# Altium schematic sheet ADC_Reference_Voltage.SchDoc
size A4; CompanyName: Technische Hochschule Nürnberg Georg Simon Ohm; Organization: UltraZohm; Address1: Kesslerplatz 12; Address2: 90489 Nürnberg; Address3: GERMANY; DocumentNumber: 8; SheetNumber: 8; SheetTotal: 9; Website: www.ultrazohm.com
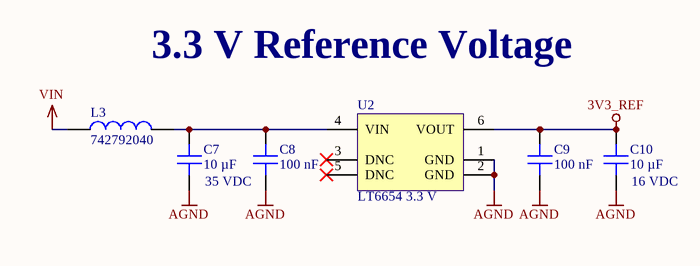
[diagram p0: ADC_Reference_Voltage.SchDoc]

## Parts
C7  10 µF  Voltage Rating: 35 VDC  [CAPC_0805_L]
C8  100 nF  [C_0603]
C9  100 nF  [C_0603]
C10  10 µF  Voltage Rating: 16 VDC  [C_0603]
L3  742792040  [WE-CBF_0805_High Current]
U2  LT6654 3.3 V  [SOT95P280X100-6N]

## Nets
3V3_REF: C9.2 C10.2 U2.6(VOUT)
AGND: C7.1 C8.1 C9.1 C10.1 U2.1(GND) U2.2(GND)
VIN: L3.1
NetC7_2: C7.2 C8.2 L3.2 U2.4(VIN)

Not connected (* = marked no-connect by the designer): U2 3(DNC)* 5(DNC)*

## Notes on the sheet
- 3.3 V Reference Voltage
- Title
- Revision:
- Design Engineer:
- Date:
- Project:
- Sheet
- of

## Library data of the parts
C7 = GRM21BR6YA106KE43L: Capacitor 0805, 35 VDC, 10 µF, X5R; Manufacturer: Murata Electronics; Tolerance: 10 %; Created from: AGeiger; Manufacturer Part Number: GRM21BR6YA106KE43L; PartID: 28; Created On: 20.12.2020 13:54:13; ComponentLink1Description: Datasheet; ComponentLink1URL: https://www.mouser.de/datasheet/2/281/murata_03052018_GRM_Series_1-1310166.pdf; Component Type: Capacitor 0805; Device Package: 0805; Last Updated: 25.08.2022 14:37:40; Mounting Type: SMD; Operating Temperature: -55 - 85°C; Series: GRM; Supplier 1: Mouser; Supplier Part Number 1: 81-GRM21BR6YA106KE3L; Type: Capacitor; Value: 10 µF; Live Cycle Status: 1; LCSC Part Number: C162422; Stock number: Labor SMD Container
C8 C9 = CC0603KRX7R9BB104: Capacitor 0603, 50 VDC, 100 nF, X7R; Manufacturer: YAGEO; Tolerance: 10 %; Voltage Rating: 50 VDC; Created from: AGeiger; Manufacturer Part Number: CC0603KRX7R9BB104; PartID: 102; Created On: 22.08.2022 14:35:53; ComponentLink1Description: Datasheet; ComponentLink1URL: https://datasheet.lcsc.com/lcsc/1809301912_YAGEO-CC0603KRX7R9BB104_C14663.pdf; Component Type: Capacitor 0603; Device Package: 0603; Last Updated: 22.08.2022 14:35:53; Mounting Type: SMD; Operating Temperature: -55 - 125°C; Series: X7R; Supplier 1: LCSC; Supplier Part Number 1: C14663; Supplier 2: Mouser; Supplier Part Number 2: 603-CC603KRX7R9BB104; Type: Capacitor; Value: 100 nF; Live Cycle Status: 1; LCSC Part Number: C14663
C10 = CL10A106MO8NQNC: Capacitor 0603, 16 VDC, 10 µF, X5R; Manufacturer: Samsung Electro-Mechanics; Tolerance: 20 %; Created from: AGeiger; Manufacturer Part Number: CL10A106MO8NQNC; PartID: 101; Created On: 22.08.2022 13:56:44; ComponentLink1Description: Datasheet; ComponentLink1URL: https://datasheet.lcsc.com/lcsc/1810261909_Samsung-Electro-Mechanics-CL10A106MO8NQNC_C92487.pdf; Component Type: Capacitor 0603; Device Package: 0603; Last Updated: 22.08.2022 13:56:44; Mounting Type: SMD; Operating Temperature: -55 - 85°C; Supplier 1: LCSC; Supplier Part Number 1: C92487; Type: Capacitor; Value: 10 µF; Live Cycle Status: 1; LCSC Part Number: C92487
L3 = 742792040: Inductance, 0805, 100 MHz, 600 Ohm, 2 A; Manufacturer: Wurth Elektronik; Type: Inductance SMD; DC current: 2 A; Value: 600 Ohm; Created from: AGeiger; Manufacturer Part Number: 742792040; PartID: 1; Created On: 18.01.2021 14:53:17; ComponentLink1Description: Datasheet; ComponentLink1URL: https://www.mouser.de/datasheet/2/445/742792040-1720361.pdf; Component Type: Inductance; Device Package: 0805; Last Updated: 29.08.2022 15:04:37; Mounting Type: SMD; Operating Temperature: -55 - 125 °C; Series: WE-CBF; Supplier 1: Mouser; Supplier Part Number 1: 710-742792040; Live Cycle Status: 1; Stock number: not stored; LCSC Part Number: C2661857
U2 = LT6654AIS6-3.3#TRMPBF: Voltage Reference, 3.3V, ±0.05%, ±10mA; Manufacturer: Analog Devices; Created from: AGeiger; Manufacturer Part Number: LT6654AIS6-3.3#TRMPBF; PartID: 11; Created On: 25.08.2022 15:15:35; ComponentLink1Description: Datasheet; ComponentLink1URL: https://datasheet.lcsc.com/lcsc/2009111208_Analog-Devices-LT6654AIS6-3-3-TRMPBF_C673263.pdf; Component Type: Voltage Reference; Device Package: SMD; Last Updated: 25.08.2022 15:17:51; Mounting Type: SMD; Operating Temperature: -40 - 85 °C; Series: LT6654; Supplier 1: Mouser; Supplier Part Number 1: 584-6654AIS633TRMPBF; Type: Voltage Reference; Value: LT6654 3.3 V; Live Cycle Status: 1; LCSC Part Number: C673263; Stock number: not stored